# EAGLE design WQMS (EAGLE 9.5.2)
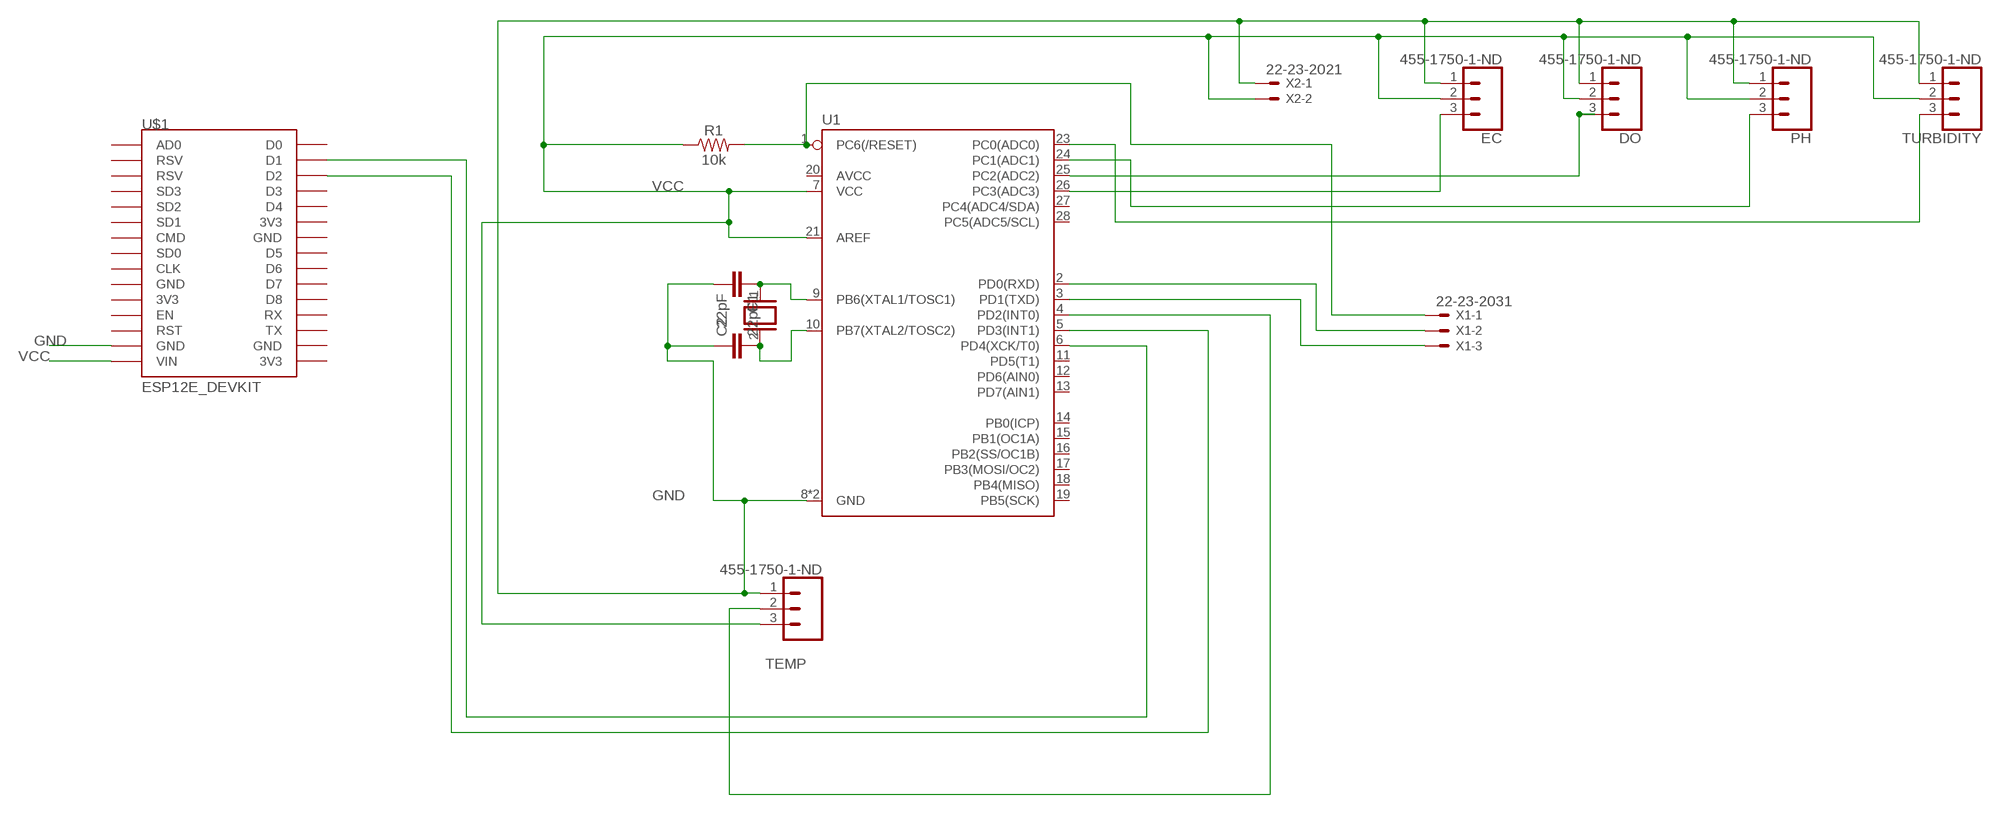
[diagram p0: schematic, sheet 1]

## Parts
C1  22pF  22PF-PTH-2.54MM-200V-5%  [CAP-PTH-2.54]
C2  22pF  22PF-PTH-2.54MM-200V-5%  [CAP-PTH-2.54]
DO  455-1750-1-ND  CONN_03  [1X03]
EC  455-1750-1-ND  CONN_03  [1X03]
PH  455-1750-1-ND  CONN_03  [1X03]
Q1  XTAL  [Q]
R1  10k  10KOHM-HORIZ-1/4W-1%  [AXIAL-0.3]
TEMP  455-1750-1-ND  CONN_03  [1X03]
TURBIDITY  455-1750-1-ND  CONN_03  [1X03]
U1  328P  ATMEGA328P_PDIP  [DIP28]
U$1  ESP12E_DEVKIT  [ESP12E_DEVKIT]
X1  22-23-2031  [22-23-2031]
X2  22-23-2021  [22-23-2021]

## Nets
GND: C1.2 C2.1 DO.1 EC.1 PH.1 TEMP.1 TURBIDITY.1 U1.8(GND) U1.22(GND) U$1.GND@1(GND) X2.1
N$1: C1.1 Q1.1 U1.9(PB6(XTAL1/TOSC1))
N$2: C2.2 Q1.2 U1.10(PB7(XTAL2/TOSC2))
N$3: TEMP.2 U1.4(PD2(INT0))
N$5: TURBIDITY.3 U1.23(PC0(ADC0))
N$6: PH.3 U1.24(PC1(ADC1))
N$7: DO.3 U1.25(PC2(ADC2))
N$8: U1.3(PD1(TXD)) X1.3
N$9: U1.6(PD4(XCK/T0)) U$1.D1
N$10: U1.5(PD3(INT1)) U$1.D2
N$11: EC.3 U1.26(PC3(ADC3))
N$12: U1.2(PD0(RXD)) X1.2
VCC: DO.2 EC.2 PH.2 R1.P$1 R1.P$2 TEMP.3 TURBIDITY.2 U1.1(PC6(/RESET)) U1.7(VCC) U1.21(AREF) U$1.VIN X1.1 X2.2
Unconnected: U1.11(PD5(T1)) U1.12(PD6(AIN0)) U1.13(PD7(AIN1)) U1.14(PB0(ICP)) U1.15(PB1(OC1A)) U1.16(PB2(SS/OC1B)) U1.17(PB3(MOSI/OC2)) U1.18(PB4(MISO)) U1.19(PB5(SCK)) U1.20(AVCC) U1.27(PC4(ADC4/SDA)) U1.28(PC5(ADC5/SCL)) U$1.3V3@0(3V3) U$1.3V3@1(3V3) U$1.3V3@2(3V3) U$1.AD0 U$1.CLK U$1.CMD U$1.D0 U$1.D3 U$1.D4 U$1.D5 U$1.D6 U$1.D7 U$1.D8 U$1.EN U$1.GND@0(GND) U$1.GND@2(GND) U$1.GND@3(GND) U$1.RST U$1.RSV@0(RSV) U$1.RSV@1(RSV) U$1.RX U$1.SD0 U$1.SD1 U$1.SD2 U$1.SD3 U$1.TX

## Library data of the parts
C1 C2 = SparkFun-Capacitors:22PF: 22pF ceramic capacitors A capacitor is a passive two-terminal electrical component used to store electrical energy temporarily in an electric field.; PROD_ID: CAP-09128
DO EC PH TEMP TURBIDITY = SparkFun-Connectors:CONN_03: Multi connection point. Often used as Generic Header-pin footprint for 0.1 inch spaced/style header connections On any of the 0.1 inch spaced packages, you can populate with these: Break Away Headers - Straight <https://www.sparkfun.com/products/116> (PRT-00116) Break Away Male Headers - Right Angle <https://www.sparkfun.com/products/553> (PRT-00553) Female Headers <https://www.sparkfun.com/products/115> (PRT-00115) Break Away Headers - Machine Pin <https://www.sparkfun.com/products/117> (PRT-00117) Break Away Female Headers - Swiss Machine Pin <https://www.sparkfun.com/products/743> (PRT-00743) Stackable Header - 3 Pin (Female, 0.1") <https://www.sparkfun.com/products/13875> (PRT-13875) For SCREWTERMINALS and SPRING TERMINALS visit here: Screw Terimnals on SparkFun.com <https://www.sparkfun.com/search/results?term=Screw+Terminals> (5mm/3.5mm/2.54mm spacing) This device is also useful as a general connection point to wire up your design to another part of your project. Our various solder wires solder well into these plated through hole pads. Hook-Up Wire - Assortment (Stranded, 22 AWG) <https://www.sparkfun.com/products/11375> (PRT-11375) Hook-Up Wire - Assortment (Solid Core, 22 AWG) <https://www.sparkfun.com/products/11367> (PRT-11367) View the entire wire category on our website here <https://www.sparkfun.com/categories/141> Special notes: Molex polarized connector foot print use with SKU : PRT-08232 with associated crimp pins and housings.; PROD_ID: XXX-00000
Q1 = special:XTAL: CRYSTAL
R1 = SparkFun-Resistors:10KOHM: 10kΩ resistor A resistor is a passive two-terminal electrical component that implements electrical resistance as a circuit element. Resistors act to reduce current flow, and, at the same time, act to lower voltage levels within circuits. - Wikipedia; PROD_ID: RES-12183
U1 = SparkFun-IC-Microcontroller:ATMEGA328P_PDIP: Atmel 328P Through hole ATMEGA328P uC used in the Arduino 32kb flash, 1k EEPROM, 2k SRAM Datasheet <http://www.sparkfun.com/datasheets/Components/SMD/ATMega328.pdf> SparkFun Products Storefront component: AVR 28 Pin 20MHz 32K 6A/D - ATMega328P <https://www.sparkfun.com/products/9061> (COM-09061) SparkFun Simon Says - Through-Hole Soldering Kit <https://www.sparkfun.com/products/10547> (KIT-10547) SparkFun Learn to Solder - Simon Says <https://www.sparkfun.com/products/13708> (KIT-13708) SparkFun BigTime Watch Kit <https://www.sparkfun.com/products/11734> (KIT-11734) SparkFun ClockIt <https://www.sparkfun.com/products/10930> (KIT-10930) SparkFun Serial Enabled LCD Kit <https://www.sparkfun.com/products/10097> (LCD-10097) SparkFun Simon Tilts - Through Hole Soldering Kit <https://www.sparkfun.com/products/12634> (KIT-12634) SparkFun Frequency Counter Kit <https://www.sparkfun.com/products/10140> (KIT-10140) FabFM Radio Kit <https://www.sparkfun.com/products/11043> (KIT-11043) SparkFun Binary Blaster Kit <https://www.sparkfun.com/products/12037> (KIT-12037) SparkFun Metro-Gnome <https://www.sparkfun.com/products/9236> (KIT-09236) ATmega328 with Arduino Optiboot (Uno) <https://www.sparkfun.com/products/10524> (DEV-10524); PROD_ID: IC-09136
U$1 = ESP12E_DEVKIT:ESP12E_DEVKIT: ESP12E DEVKIT BOARD
X1 = con-molex:22-23-2031: .100" (2.54mm) Center Header - 3 Pin; MF: MOLEX; MPN: 22-23-2031; OC_FARNELL: 1462950; OC_NEWARK: 30C0862
X2 = con-molex:22-23-2021: .100" (2.54mm) Center Header - 2 Pin; MF: MOLEX; MPN: 22-23-2021; OC_FARNELL: 1462926; OC_NEWARK: 25C3832

## Board
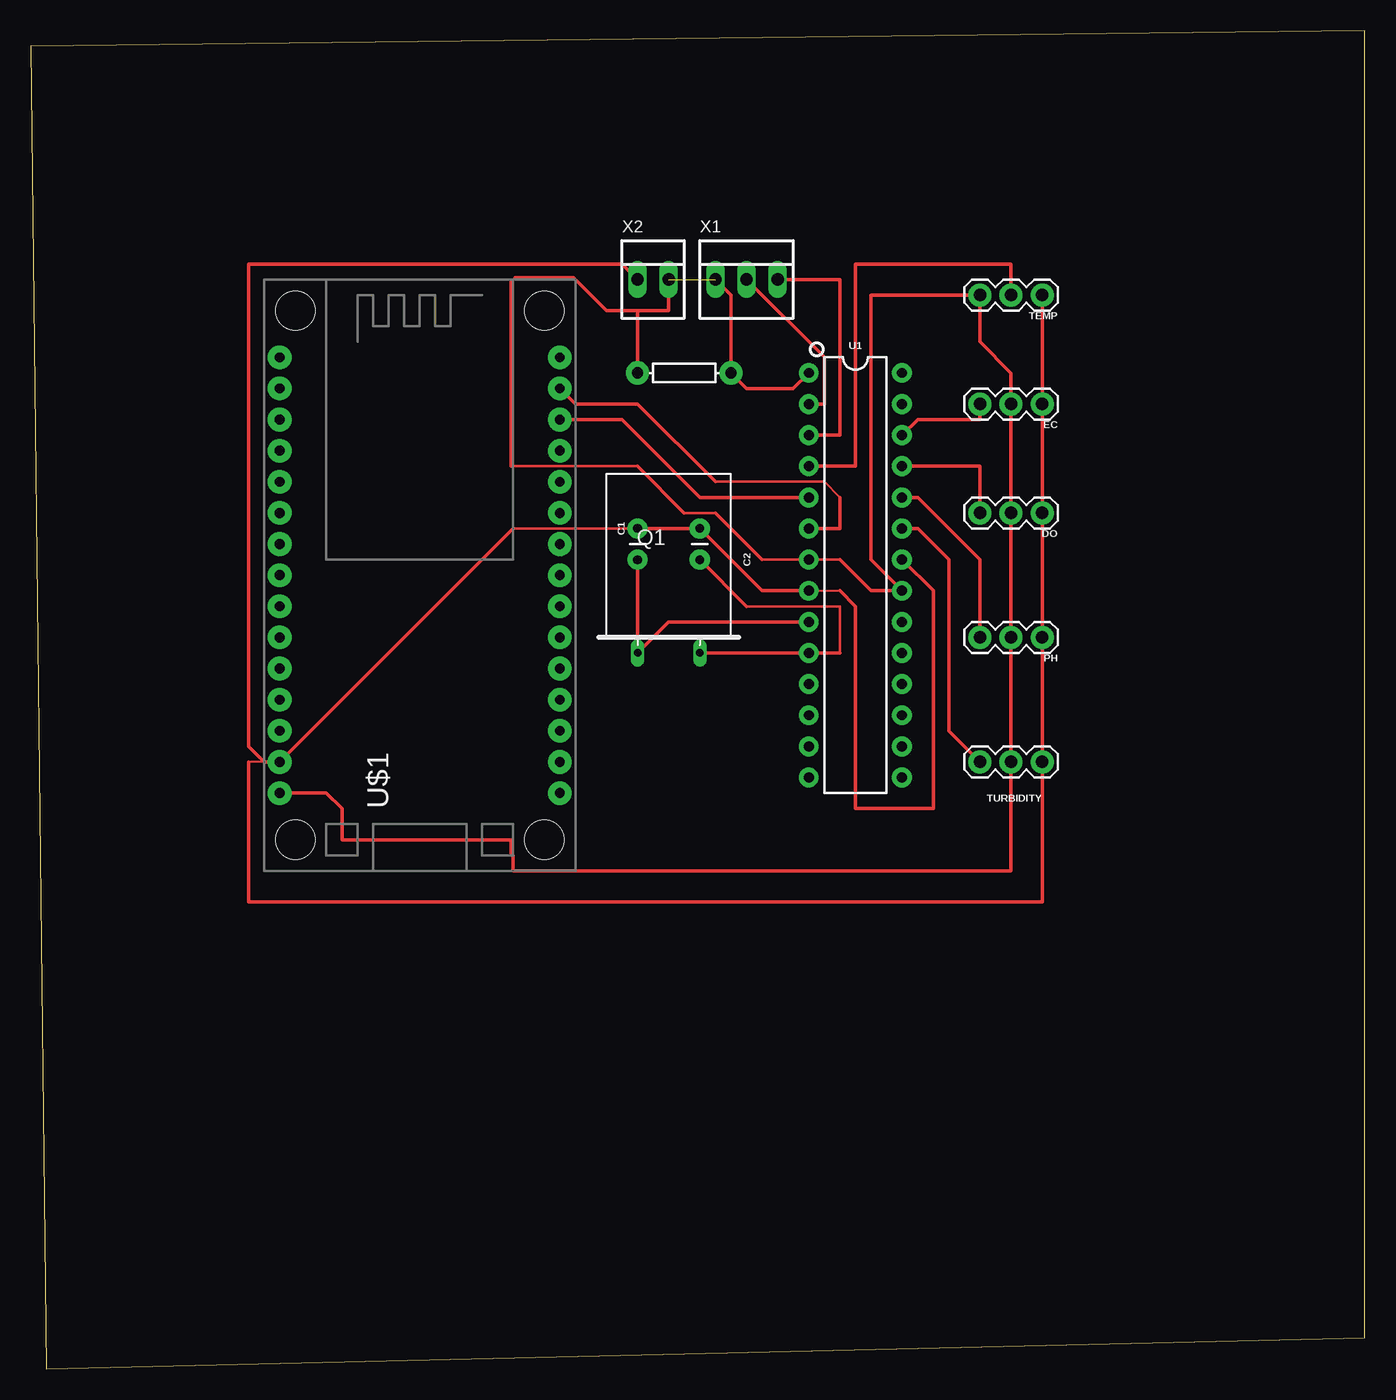
[diagram p1: board, top side]

Size 108.89 x 109.21 mm. Coordinates in mm from the lower left corner, seen from the top.
Outline: 1.27,0 108.89,2.54 108.89,109.21 0,107.94 1.27,0
Copper layers (1*16): Top 0.035mm / dielectric 1.5mm / Bottom 0.035mm
Design rules "default": minimum track width 6mil, minimum drill 0.35mm, track to track 6mil, track to pad 6mil, pad to pad 6mil, via to via 6mil, smd to smd 6mil, copper to edge 40mil, drill to drill 6mil, minimum pad ring 10mil, minimum via ring 8mil, stop-mask expansion 4mil, vias tented up to drill 0mil, thermal gap 10mil

### Footprints (pad centres in the part's own frame; a part is rotated, then mirrored left to right if it is on the bottom)
CAP-PTH-2.54 = drill 0.7 pad 1.651: 1 -1.27,0; 2 1.27,0
1X03 = drill 1.016 pad 1.88: 1 0,0; 2 2.54,0; 3 5.08,0
Q = drill 0.61 long: 1 -2.54,-7.62; 2 2.54,-7.62
AXIAL-0.3 = drill 0.9 pad 1.88: P$1 -3.81,0; P$2 3.81,0
DIP28 = drill 0.813 pad 1.626: 1 -16.51,-3.81; 2 -13.97,-3.81; 3 -11.43,-3.81; 4 -8.89,-3.81; 5 -6.35,-3.81; 6 -3.81,-3.81; 7 -1.27,-3.81; 8 1.27,-3.81; 9 3.81,-3.81; 10 6.35,-3.81; 11 8.89,-3.81; 12 11.43,-3.81; 13 13.97,-3.81; 14 16.51,-3.81; 15 16.51,3.81; 16 13.97,3.81; 17 11.43,3.81; 18 8.89,3.81; 19 6.35,3.81; 20 3.81,3.81; 21 1.27,3.81; 22 -1.27,3.81; 23 -3.81,3.81; 24 -6.35,3.81; 25 -8.89,3.81; 26 -11.43,3.81; 27 -13.97,3.81; 28 -16.51,3.81
ESP12E_DEVKIT = drill 0.8 pad 1.93: 3V3@0 -11.43,-7.62; 3V3@1 11.43,5.08; 3V3@2 11.43,-17.78; AD0 -11.43,17.78; CLK -11.43,-2.54; CMD -11.43,2.54; D0 11.43,17.78; D1 11.43,15.24; D2 11.43,12.7; D3 11.43,10.16; D4 11.43,7.62; D5 11.43,0; D6 11.43,-2.54; D7 11.43,-5.08; D8 11.43,-7.62; EN -11.43,-10.16; GND@0 -11.43,-5.08; GND@1 -11.43,-15.24; GND@2 11.43,2.54; GND@3 11.43,-15.24; RST -11.43,-12.7; RSV@0 -11.43,15.24; RSV@1 -11.43,12.7; RX 11.43,-10.16; SD0 -11.43,0; SD1 -11.43,5.08; SD2 -11.43,7.62; SD3 -11.43,10.16; TX 11.43,-12.7; VIN -11.43,-17.78 | hole 3.2: -10.16,21.59; 10.16,21.59; 10.16,-21.59; -10.16,-21.59
22-23-2031 = drill 1 long: 1 -2.54,0; 2 0,0; 3 2.54,0
22-23-2021 = drill 1 long: 1 -1.27,0; 2 1.27,0

### Placement (x,y rotation side)
C1  49.53,67.31 90 top
C2  54.61,67.31 270 top
DO  82.55,69.85 180 top
EC  82.55,78.74 180 top
PH  82.55,59.69 180 top
Q1  52.07,66.04 0 top
R1  53.34,81.28 0 top
TEMP  82.55,87.63 180 top
TURBIDITY  82.55,49.53 180 top
U1  67.31,64.77 270 top
U$1  31.75,64.77 0 top
X1  58.42,88.9 0 top
X2  50.8,88.9 0 top

### Tracks (layer width: path | path; a pad name or v marks a point on that pad's centre or on a via)
GND
  Top 0.152: U$1.GND@1 17.78,49.53 | U1.8 66.04,63.5
  Top 0.203: 39.37,68.58 C1.2
  Top 0.305: TEMP.1 EC.1 DO.1 PH.1 TURBIDITY.1 82.55,38.1 17.78,38.1 17.78,49.53 | U1.8 59.69,63.5 C2.1 C1.2 | 39.37,68.58 U$1.GND@1 19.05,49.53 17.78,50.8 17.78,90.17 48.26,90.17 X2.1 | 66.04,63.5 67.31,62.23 67.31,45.72 73.66,45.72 73.66,63.5 U1.22
N$1
  Top 0.305: U1.9 52.07,60.96 Q1.1 C1.1
N$2
  Top 0.203: 66.04,58.42 66.04,62.23 58.42,62.23
  Top 0.305: Q1.2 U1.10 66.04,58.42 | 58.42,62.23 C2.2
N$3
  Top 0.305: TEMP.2 80.01,90.17 67.31,90.17 67.31,73.66 U1.4
N$5
  Top 0.305: U1.23 72.39,68.58 74.93,66.04 74.93,52.07 TURBIDITY.3
N$6
  Top 0.305: U1.24 72.39,71.12 77.47,66.04 PH.3
N$7
  Top 0.305: U1.25 77.47,73.66 DO.3
N$8
  Top 0.305: U1.3 66.04,76.2 66.04,88.9 X1.3
N$9
  Top 0.203: 66.04,71.12 64.77,72.39 55.88,72.39
  Top 0.305: U1.6 66.04,68.58 66.04,71.12 | 55.88,72.39 49.53,78.74 44.45,78.74 U$1.D1
N$10
  Top 0.305: U1.5 54.61,71.12 48.26,77.47 U$1.D2
N$11
  Top 0.305: U1.26 72.39,77.47 77.47,77.47 EC.3
N$12
  Top 0.305: U1.2 64.77,78.74 64.77,82.55 X1.2
VCC  (1 unrouted)
  Top 0.152: 39.22,88.75 39.52,89.05 | 39.22,42.06 39.37,41.91
  Top 0.203: 59.69,66.04 U1.7 66.04,66.04 | 39.22,73.66 49.53,73.66 | 53.34,69.85 55.88,69.85
  Top 0.305: 39.22,73.66 39.22,88.75 | 66.04,66.04 68.58,63.5 U1.21 68.58,66.04 68.58,87.63 TEMP.3 77.47,83.82 80.01,81.28 EC.2 DO.2 PH.2 TURBIDITY.2 80.01,40.64 39.37,40.64 39.37,41.91 | 49.53,86.36 46.99,86.36 44.3,89.05 39.52,89.05 | 49.53,86.36 52.07,86.36 X2.2 | U1.1 62.23,80.01 58.42,80.01 R1.P$2 57.15,87.63 X1.1 | R1.P$1 49.53,86.36 | 49.53,73.66 53.34,69.85 | 55.88,69.85 59.69,66.04 | U$1.VIN 24.13,46.99 25.4,45.72 25.4,43.18 39.22,43.18 39.22,42.06